# Altium schematic sheet summing_circuit.SchDoc
size A4
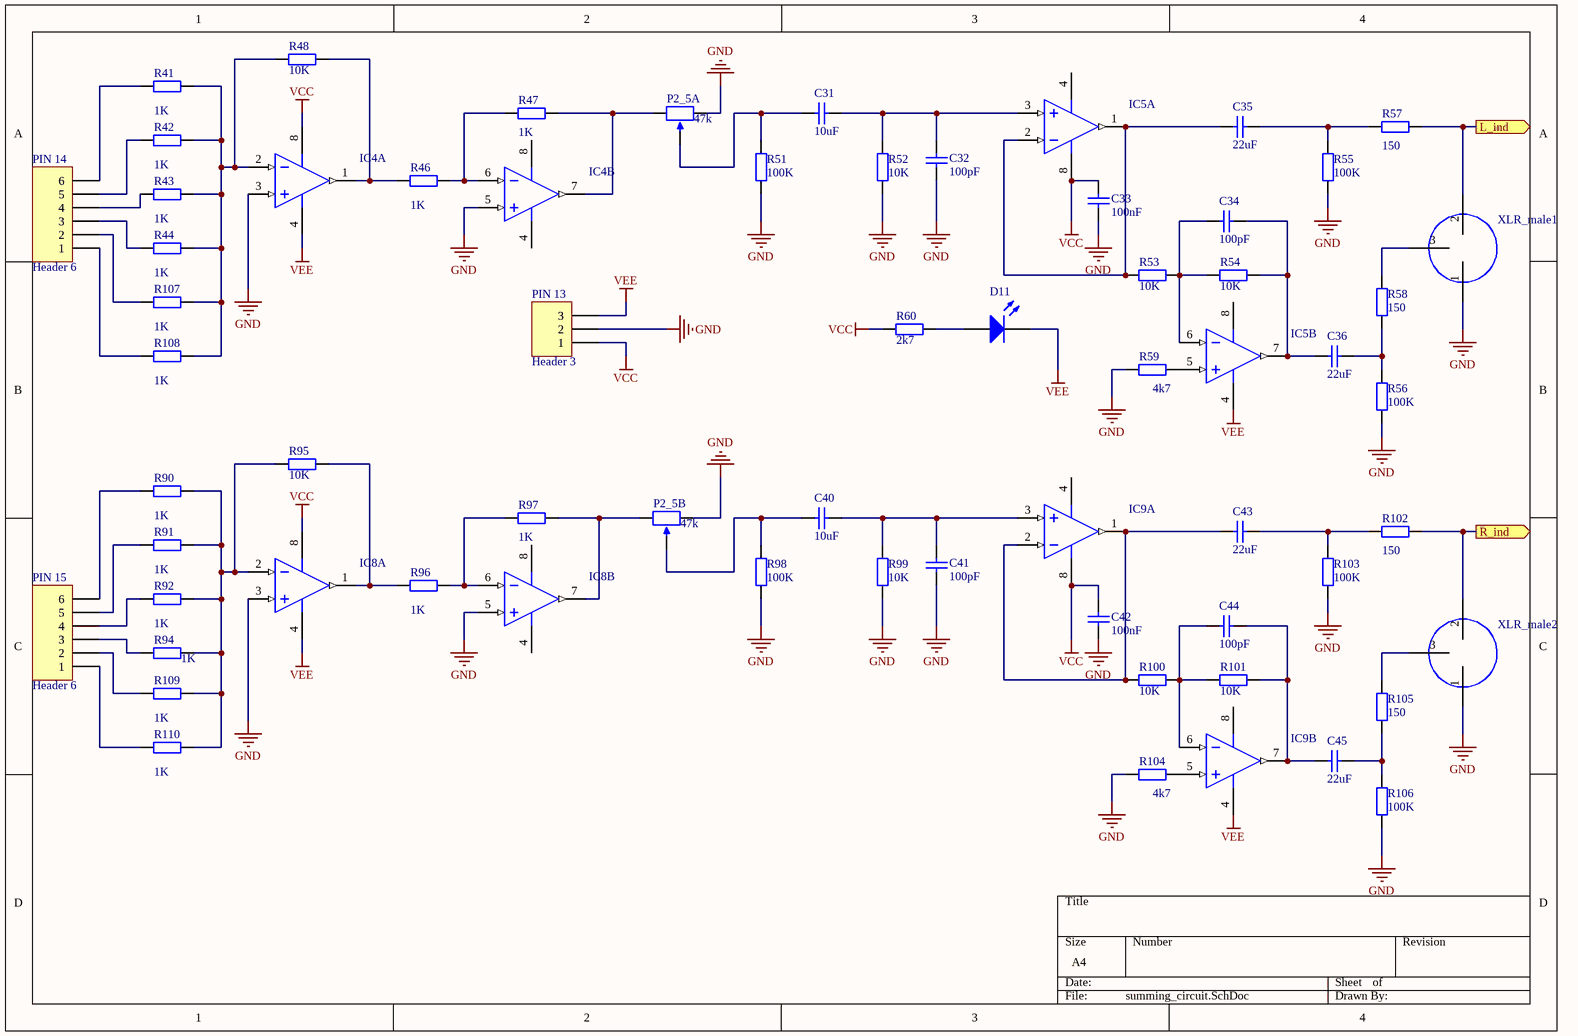
[diagram p0: summing_circuit.SchDoc]

## Parts
C31  value 10uF  [Capacitor 10uF]  (hidden comment: Cap)
C32  value 100pF  [Capacitor 100pF]  (hidden comment: Cap)
C33  value 100nF  [Capacitor 22nF, 47nF, 100nF]  (hidden comment: Cap)
C34  value 100pF  [Capacitor 100pF]  (hidden comment: Cap)
C35  value 22uF  [Capacitor 100uF]  (hidden comment: Cap)
C36  value 22uF  [Capacitor 100uF]  (hidden comment: Cap)
C40  value 10uF  [Capacitor 10uF]  (hidden comment: Cap)
C41  value 100pF  [Capacitor 100pF]  (hidden comment: Cap)
C42  value 100nF  [Capacitor 22nF, 47nF, 100nF]  (hidden comment: Cap)
C43  value 22uF  [Capacitor 100pF]  (hidden comment: Cap)
C44  value 100pF  [Capacitor 100uF]  (hidden comment: Cap)
C45  value 22uF  [Capacitor 100uF]  (hidden comment: Cap)
D11  LED1  [LED]  (value not drawn)
IC4  LM833DR2G  [OPAMP_LM833]  (value not drawn)  (parts A,B of 2)
IC5  LM833DR2G  [OPAMP_LM833]  (value not drawn)  (parts A,B of 2)
IC8  LM833DR2G  [OPAMP_LM833]  (value not drawn)  (parts A,B of 2)
IC9  LM833DR2G  [OPAMP_LM833]  (value not drawn)  (parts A,B of 2)
P2_5A  value 47k  [header_3]  (hidden comment: RPot)
P2_5B  value 47k  [header_3]  (hidden comment: RPot)
PIN_13  Header 3  [header_3]
PIN_14  Header 6  [header_6]
PIN_15  Header 6  [header_6]
R41  value 1K  [C1206]  (hidden comment: Res2)
R42  value 1K  [C1206]  (hidden comment: Res2)
R43  value 1K  [C1206]  (hidden comment: Res2)
R44  value 1K  [C1206]  (hidden comment: Res2)
R46  value 1K  [C1206]  (hidden comment: Res2)
R47  value 1K  [C1206]  (hidden comment: Res2)
R48  value 10K  [C1206]  (hidden comment: Res2)
R51  value 100K  [C1206]  (hidden comment: Res2)
R52  value 10K  [C1206]  (hidden comment: Res2)
R53  value 10K  [C1206]  (hidden comment: Res2)
R54  value 10K  [C1206]  (hidden comment: Res2)
R55  value 100K  [C1206]  (hidden comment: Res2)
R56  value 100K  [C1206]  (hidden comment: Res2)
R57  value 150  [C1206]  (hidden comment: Res2)
R58  value 150  [C1206]  (hidden comment: Res2)
R59  value 4k7  [C1206]  (hidden comment: Res2)
R60  value 2k7  [C1206]  (hidden comment: Res2)
R90  value 1K  [C1206]  (hidden comment: Res2)
R91  value 1K  [C1206]  (hidden comment: Res2)
R92  value 1K  [C1206]  (hidden comment: Res2)
R94  value 1K  [C1206]  (hidden comment: Res2)
R95  value 10K  [C1206]  (hidden comment: Res2)
R96  value 1K  [C1206]  (hidden comment: Res2)
R97  value 1K  [C1206]  (hidden comment: Res2)
R98  value 100K  [C1206]  (hidden comment: Res2)
R99  value 10K  [C1206]  (hidden comment: Res2)
R100  value 10K  [C1206]  (hidden comment: Res2)
R101  value 10K  [C1206]  (hidden comment: Res2)
R102  value 150  [C1206]  (hidden comment: Res2)
R103  value 100K  [C1206]  (hidden comment: Res2)
R104  value 4k7  [C1206]  (hidden comment: Res2)
R105  value 150  [C1206]  (hidden comment: Res2)
R106  value 100K  [C1206]  (hidden comment: Res2)
R107  value 1K  [C1206]  (hidden comment: Res2)
R108  value 1K  [C1206]  (hidden comment: Res2)
R109  value 1K  [C1206]  (hidden comment: Res2)
R110  value 1K  [C1206]  (hidden comment: Res2)
XLR_male1  XLR_male  [XLR_MALE_Neutrik_NC3_MAV]  (value not drawn)
XLR_male2  XLR_male  [XLR_MALE_Neutrik_NC3_MAV]  (value not drawn)

## Ports
L_ind (out), R_ind (out)

## Nets
GND: C32.1 C33.1 C41.1 C42.1 IC4.3(IN1+) IC4.5(IN2+) IC8.3(IN1+) IC8.5(IN2+) P2_5A.3(BOT) P2_5B.3(BOT) PIN_13.1(2) R51.1 R52.1 R55.1 R56.1 R59.1 R98.1 R99.1 R103.1 R104.1 R106.1 XLR_male1.1(GND) XLR_male2.1(GND)
VCC: C33.2 C42.2 IC4.8(VCC) IC5.8(VCC) IC8.8(VCC) IC9.8(VCC) PIN_13.2(1) R60.1
VEE: D11.2(K) IC4.4(VEE) IC5.4(VEE) IC8.4(VEE) IC9.4(VEE) PIN_13.3
L_ind: R57.2 XLR_male1.2(Pos) ; port L_ind
R_ind: R102.2 XLR_male2.2(Pos) ; port R_ind
NetC31_1: C31.1 P2_5A.2(TAP) R51.2
NetC31_2: C31.2 C32.2 IC5.3(IN1+) R52.2
NetC34_1: C34.1 IC5.6(IN2-) R53.2 R54.1
NetC34_2: C34.2 C36.1 IC5.7(OUT2) R54.2
NetC35_1: C35.1 IC5.1(OUT1) IC5.2(IN1-) R53.1
NetC35_2: C35.2 R55.2 R57.1
NetC36_2: C36.2 R56.2 R58.1
NetC40_1: C40.1 P2_5B.2(TAP) R98.2
NetC40_2: C40.2 C41.2 IC9.3(IN1+) R99.2
NetC43_1: C43.1 IC9.1(OUT1) IC9.2(IN1-) R100.1
NetC43_2: C43.2 R102.1 R103.2
NetC44_1: C44.1 IC9.6(IN2-) R100.2 R101.1
NetC44_2: C44.2 C45.1 IC9.7(OUT2) R101.2
NetC45_2: C45.2 R105.1 R106.2
NetD11_1: D11.1(A) R60.2
NetIC4_1: IC4.1(OUT1) R46.1 R48.2
NetIC4_2: IC4.2(IN1-) R41.2 R42.2 R43.2 R44.2 R48.1 R107.2 R108.2
NetIC4_6: IC4.6(IN2-) R46.2 R47.1
NetIC4_7: IC4.7(OUT2) P2_5A.1(TOP) R47.2
NetIC5_5: IC5.5(IN2+) R59.2
NetIC8_1: IC8.1(OUT1) R95.2 R96.1
NetIC8_2: IC8.2(IN1-) R90.2 R91.2 R92.2 R94.2 R95.1 R109.2 R110.2
NetIC8_6: IC8.6(IN2-) R96.2 R97.1
NetIC8_7: IC8.7(OUT2) P2_5B.1(TOP) R97.2
NetIC9_5: IC9.5(IN2+) R104.2
NetPIN_14_1: PIN_14.1(2) R107.1
NetPIN_14_2: PIN_14.2(1) R108.1
NetPIN_14_3: PIN_14.3 R44.1
NetPIN_14_4: PIN_14.4 R43.1
NetPIN_14_5: PIN_14.5 R42.1
NetPIN_14_6: PIN_14.6 R41.1
NetPIN_15_1: PIN_15.1(2) R109.1
NetPIN_15_2: PIN_15.2(1) R110.1
NetPIN_15_3: PIN_15.3 R94.1
NetPIN_15_4: PIN_15.4 R92.1
NetPIN_15_5: PIN_15.5 R91.1
NetPIN_15_6: PIN_15.6 R90.1
NetR58_2: R58.2 XLR_male1.3(negative)
NetR105_2: R105.2 XLR_male2.3(negative)

## Library data of the parts
C31 C32 C34 C35 C40 C41 C43 C44 = Cap: Capacitor; Published: 8-Jun-2000; LatestRevisionDate: 17-Jul-2002; LatestRevisionNote: Re-released for DXP Platform.; PackageReference: RAD-0.3; Publisher: Altium Limited; PackageDescription: Radial Cap, Thru-Hole; 2 Leads; 0.3 in Pin Spacing
C33 C42 = Cap_3: Capacitor; Published: 8-Jun-2000; LatestRevisionDate: 17-Jul-2002; LatestRevisionNote: Re-released for DXP Platform.; PackageReference: RAD-0.3; Publisher: Altium Limited; PackageDescription: Radial Cap, Thru-Hole; 2 Leads; 0.3 in Pin Spacing
C36 C45 = Cap_5: Capacitor; Published: 8-Jun-2000; LatestRevisionDate: 17-Jul-2002; LatestRevisionNote: Re-released for DXP Platform.; PackageReference: RAD-0.3; Publisher: Altium Limited; PackageDescription: Radial Cap, Thru-Hole; 2 Leads; 0.3 in Pin Spacing
D11 = LED1: Typical RED GaAs LED; Published: 8-Jun-2000; LatestRevisionDate: 08-Jul-2005; LatestRevisionNote: Mech Layer 1 removed.; PackageReference: LED-1; Publisher: Altium Limited; PackageDescription: LED; 2 Leads
IC4 IC5 IC8 IC9 = opamp_LM833: Low Noise, Audio Dual Operational Amplifier, -40 to 85 degC, 8-Pin SOIC, Pb-Free, Tape and Reel; Manufacturer: On Semiconductor; GBW Typ (MHz): 15; SR Typ (V/uS): 7; PackageReference: SOIC-8-751-07; ComponentLink3URL: http://www.onsemi.com/pub_link/Collateral/751-07.PDF; ComponentLink2URL: http://www.onsemi.cn/pub_link/Collateral/LM833-D.PDF; PackageVersion: Rev. AK, 02/2011; ComponentLink2Description: Datasheet; Mounting Technology: Surface Mount; Packing: Tape and Reel; PackageDescription: 8-Pin Small Outline Integrated Circuit, Body 4.9 x 3.9 mm, Pitch 1.27 mm; RoHS: TRUE; ComponentLink3Description: Package Specification; DatasheetVersion: Rev. 6; ComponentLink1URL: http://www.onsemi.com/; PartNumber: LM833DR2G; ComponentLink1Description: Manufacturer URL
P2_5A P2_5B = RPot: Potentiometer; Sim Note: Enter the Resistance value and the set point into parameter fields.; Set Position: 0.5; Published: 8-Jun-2000; LatestRevisionDate: 17-Jul-2002; LatestRevisionNote: Re-released for DXP Platform.; PackageReference: VR5; Publisher: Altium Limited; PackageDescription: Variable Resistor, Thru-Hole; 3 Leads
PIN_13 = Header 3: Header, 3-Pin; LatestRevisionDate: 17-Jul-2002; LatestRevisionNote: Re-released for DXP Platform.; Publisher: Altium Limited
PIN_14 PIN_15 = Header 6: Header, 6-Pin; LatestRevisionDate: 17-Jul-2002; LatestRevisionNote: Re-released for DXP Platform.; Publisher: Altium Limited
R41-R44 R46 R47 R57-R59 R90-R92 R94 R96 R97 R102 R104 R105 R107-R110 = Res2: Resistor; Published: 8-Jun-2000; LatestRevisionDate: 17-Jul-2002; LatestRevisionNote: Re-released for DXP Platform.; PackageReference: AXIAL-0.4; Publisher: Altium Limited; PackageDescription: Axial Device, Thru-Hole; 2 Leads; 0.4 in Pin Spacing
R48 R52-R54 R95 R99-R101 = Res2_3: Resistor; Published: 8-Jun-2000; LatestRevisionDate: 17-Jul-2002; LatestRevisionNote: Re-released for DXP Platform.; PackageReference: AXIAL-0.4; Publisher: Altium Limited; PackageDescription: Axial Device, Thru-Hole; 2 Leads; 0.4 in Pin Spacing
R51 R55 R56 R98 R103 R106 = Res2_5: Resistor; Published: 8-Jun-2000; LatestRevisionDate: 17-Jul-2002; LatestRevisionNote: Re-released for DXP Platform.; PackageReference: AXIAL-0.4; Publisher: Altium Limited; PackageDescription: Axial Device, Thru-Hole; 2 Leads; 0.4 in Pin Spacing
R60 = Res_16: Resistor; Published: 8-Jun-2000; LatestRevisionDate: 17-Jul-2002; LatestRevisionNote: Re-released for DXP Platform.; PackageReference: AXIAL-0.4; Publisher: Altium Limited; PackageDescription: Axial Device, Thru-Hole; 2 Leads; 0.4 in Pin Spacing